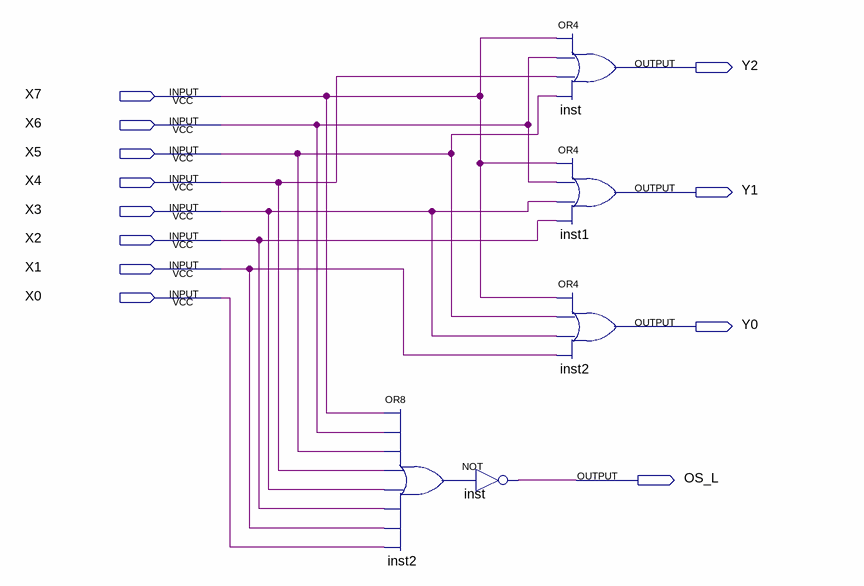
[diagram p0: schematic sheet]
// Quartus schematic PEnc8_3.bdf as structural Verilog: 5 symbols, 12 pins
module PEnc8_3 (
  input  X7,
  input  X6,
  input  X5,
  input  X4,
  input  X3,
  input  X2,
  input  X1,
  input  X0,
  output Y2,
  output Y1,
  output Y0,
  output OS_L
);

  wire inst2_out;

  or inst2 (inst2_out, X7, X6, X5, X4, X3, X2, X1, X0);
  not inst (OS_L, inst2_out);
  or inst_dup2 (Y2, X7, X6, X4, X5);
  or inst1 (Y1, X7, X6, X3, X2);
  or inst2_dup2 (Y0, X7, X5, X3, X1);
endmodule
